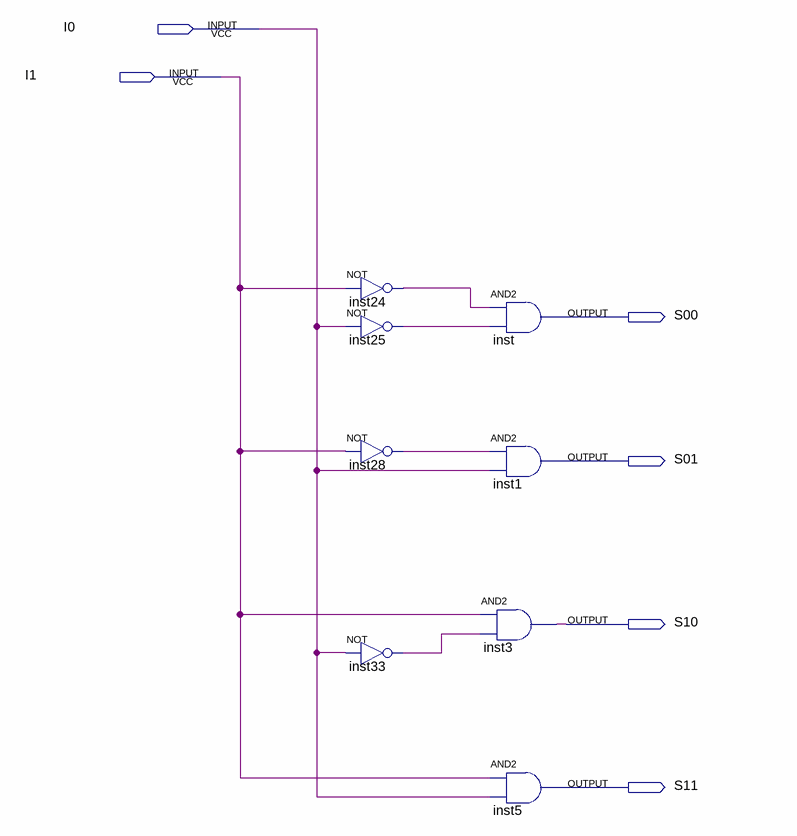
[diagram p0: schematic sheet]
// Quartus schematic decod2x4.bdf as structural Verilog: 8 symbols, 6 pins
module decod2x4 (
  input  I0,
  input  I1,
  output S00,
  output S01,
  output S10,
  output S11
);

  wire inst24_out, inst25_out, inst28_out, inst33_out;

  not inst24 (inst24_out, I1);
  not inst25 (inst25_out, I0);
  not inst28 (inst28_out, I1);
  not inst33 (inst33_out, I0);
  and inst (S00, inst24_out, inst25_out);
  and inst1 (S01, inst28_out, I0);
  and inst3 (S10, I1, inst33_out);
  and inst5 (S11, I1, I0);
endmodule
